# Altium schematic sheet Buck.SchDoc
size A
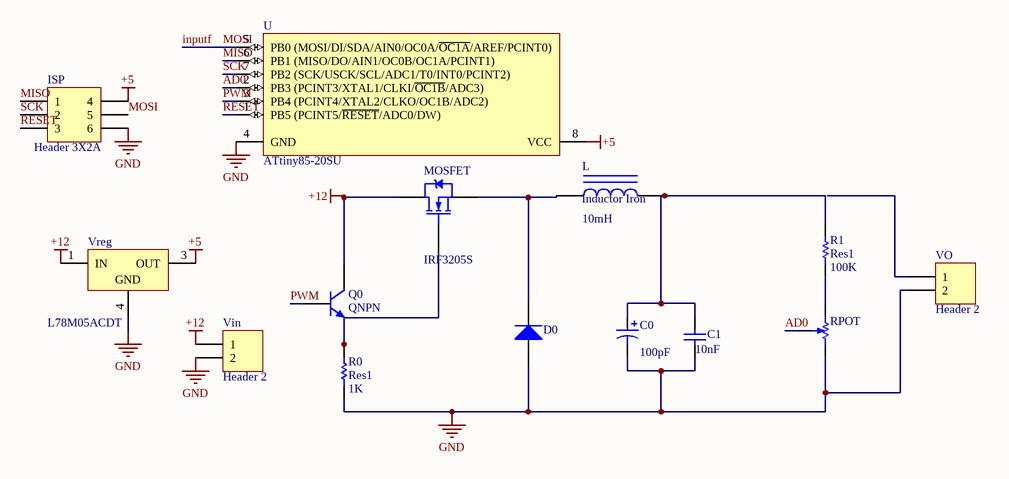
[diagram p0: Buck.SchDoc]

## Parts
C0  value 100pF  [RAD-0.2]  (hidden comment: Cap Pol1)
C1  value 10nF  [RB7.6-15]  (hidden comment: Cap)
D0  Diode BAS16  [SOT-23_L]  (value not drawn)
ISP  Header 3X2A  [HDR2X3_CEN]
L  Inductor Iron  value 10mH  [AXIAL-0.9]
MOSFET  IRF3205S  [D2PAK_L]
Q0  QNPN  [SOT-23B_L]
R0  Res1  value 1K  [j1-0603]
R1  Res1  value 100K  [j1-0603]
RPOT  RPot SM  [POT4MM-2]  (value not drawn)
U  ATtiny85-20SU  [8S2_L]
Vin  Header 2  [HDR1X2]
VO  Header 2  [HDR1X2]
Vreg  L78M05ACDT  [TO-252]

## Nets
+5: ISP.4 U.8(VCC) Vreg.3(OUT)
+12: MOSFET.2(D) Q0.1(C) Vin.1 Vreg.1(IN)
GND: C0.2 C1.1 D0.1(A) ISP.6 R0.1 RPOT.CW(+) U.4(GND) Vin.2 VO.2 Vreg.4(GND)
AD0: RPOT.W U.2(PB3_(PCINT3/XTAL1/CLKI/~{OC1B}/ADC3))
inputf: ISP.5 U.5(PB0_(MOSI/DI/SDA/AIN0/OC0A/~{OC1A}/AREF/PCINT0))  [also labelled MOSI]
MISO: ISP.1 U.6(PB1_(MISO/DO/AIN1/OC0B/OC1A/PCINT1))
PWM: Q0.2(B) U.3(PB4_(PCINT4/XTAL2/CLKO/OC1B/ADC2))
RESET: ISP.3 U.1(PB5_(PCINT5/~{RESET}/ADC0/DW))
SCK: ISP.2 U.7(PB2_(SCK/USCK/SCL/ADC1/T0/INT0/PCINT2))
NetC0_1: C0.1 C1.2 L.2 R1.2
NetD0_3: D0.3(K) L.1 MOSFET.3(S)
NetMOSFET_1: MOSFET.1(G) Q0.3(E) R0.2
NetR1_1: R1.1 RPOT.CCW(-)

Not connected (* = marked no-connect by the designer): VO 1

## Library data of the parts
C0 = Cap Pol1: Polarized Capacitor (Radial); Published: 8-Jun-2000; LatestRevisionDate: 17-Jul-2002; LatestRevisionNote: Re-released for DXP Platform.; PackageReference: RB7.6-15; Publisher: Altium Limited; PackageDescription: Polarized Capacitor (Radial); 2 Leads
C1 = Cap: Capacitor; Published: 8-Jun-2000; LatestRevisionDate: 17-Jul-2002; LatestRevisionNote: Re-released for DXP Platform.; PackageReference: RAD-0.3; Publisher: Altium Limited; PackageDescription: Radial Cap, Thru-Hole; 2 Leads; 0.3 in Pin Spacing
D0 = Diode BAS16: Silicon Switching Diode for High-Speed Switching; Note: Pin 2 is not connected and not drawn.; Published: 21-Mar-2003; LatestRevisionDate: 29-May-2009; LatestRevisionNote: IPC-7351 Footprint Added.; DatasheetVersion: Oct-1999; PackageVersion: Sep-2001; PackageReference: SOT-23; Publisher: Altium Limited; PackageDescription: 3-Pin SOT-23 Package 0.95 mm Pitch, 2.5 mm Lead Span; ComponentLink1Description: Manufacturer Link; ComponentLink1URL: http://www.infineon.com/; ComponentLink2Description: Datasheet; ComponentLink2URL: http://www.infineon.com/upload/Document/cmc_upload/documents/012/5331/bas16series.pdf
ISP = Header 3X2A: Header, 3-Pin, Dual row; LatestRevisionDate: 17-Jul-2002; LatestRevisionNote: Re-released for DXP Platform.; Publisher: Altium Limited
L = Inductor Iron: Magnetic-Core Inductor; Published: 24-Mar-1999; LatestRevisionDate: 17-Jul-2002; LatestRevisionNote: Re-released for DXP Platform.; PackageReference: AXIAL-0.9; Publisher: Altium Limited; PackageDescription: Axial Device, Thru-Hole; 2 Leads; 0.9 in Pin Spacing
MOSFET = IRF3205S: HEXFET Power MOSFET; Published: 8-Jun-2000; LatestRevisionDate: 20-Nov-2009; LatestRevisionNote: IPC-7351 Footprint Added.; DatasheetVersion: Aug-1997; PackageReference: D2PAK; Publisher: Altium Limited; PackageDescription: 3-Pin Transistor Outline Package 2.54 mm Pitch, 15.1 mm Lead Span; ComponentLink1Description: Manufacturer Link; ComponentLink1URL: http://www.irf.com/; ComponentLink2Description: Datasheet; ComponentLink2URL: http://www.irf.com/product-info/datasheets/data/irf3205s.pdf
Q0 = QNPN: NPN Bipolar Transistor; pin to pad: 1>3 3>1; Published: 8-Jun-2000; LatestRevisionDate: 29-May-2009; LatestRevisionNote: IPC-7351 Footprint Added.; PackageVersion: Aug-1999; PackageReference: SOT-23B; Publisher: Altium Limited; PackageDescription: 3-Pin SOT-23 Package 0.95 mm Pitch, 2.4 mm Lead Span
R0 R1 = Res1: Resistor; Published: 8-Jun-2000; LatestRevisionDate: 17-Jul-2002; LatestRevisionNote: Re-released for DXP Platform.; PackageReference: AXIAL-0.3; Publisher: Altium Limited; PackageDescription: Axial Device, Thru-Hole; 2 Leads; 0.3 in Pin Spacing
RPOT = RPot SM: Square Trimming Potentiometer; Published: 17-Dec-2003; DatasheetVersion: Oct-2003; PackageReference: POT4MM-2; Publisher: Altium Limited; PackageDescription: Square Trimming Potentiometer; ComponentLink1Description: Manufacturer Link; ComponentLink1URL: http://bourns.com/2/search.html
U = ATtiny85-20SU: Low Power tinyAVR® 8-Bit Microcontroller, 8K Flash Memory, 20MHz, Industrial Temperature, 8-Lead SOIC, Pb-Free; Published: 20-Nov-2009; DatasheetVersion: DOC2586I, May-2008; PackageVersion: revF, Apr-2008; PackageReference: 8S2; Publisher: Altium Limited; PackageDescription: 8-Lead, 0.208" Body, Plastic Small Outline Package (EIAJ); Supplier 1: Digi-Key; Supplier Part Number 1: ATTINY85-20SU-ND; Supplier 2: Farnell; Supplier Part Number 2: 1455164; Supplier 3: Mouser; Supplier Part Number 3: 556-ATTINY85-20SU; ComponentLink1Description: Manufacturer Link; ComponentLink1URL: http://www.atmel.com/products/AVR/tinyavr.asp?; ComponentLink2Description: Datasheet; ComponentLink2URL: http://www.atmel.com/dyn/resources/prod_documents/doc2586.pdf; ComponentLink3Description: Atmel.com Home; ComponentLink3URL: http://www.atmel.com
Vin VO = Header 2: Header, 2-Pin; LatestRevisionDate: 17-Jul-2002; LatestRevisionNote: Re-released for DXP Platform.; Publisher: Altium Limited
Vreg = L78M05ACDT: Precision 500mA Regulator; Published: 24-Aug-2001; LatestRevisionDate: 06-Jun-2005; LatestRevisionNote: PCB pads lengthened.; DatasheetVersion: Mar-1997; PackageVersion: Jun-2004; PackageReference: TO-252; Publisher: Altium Limited; PackageDescription: D-PAK/TO-252-AA; 3 Leads (1 Cropped); Body 10.1 (inc. leads) x 6.6 mm (LxW max); ComponentLink1Description: Manufacturer Link; ComponentLink1URL: http://www.st.com/; ComponentLink2Description: Datasheet; ComponentLink2URL: http://www.st.com/stonline/products/literature/ds/2147/l78m05ab.pdf